# Altium schematic sheet etapa3.SchDoc
size Letter
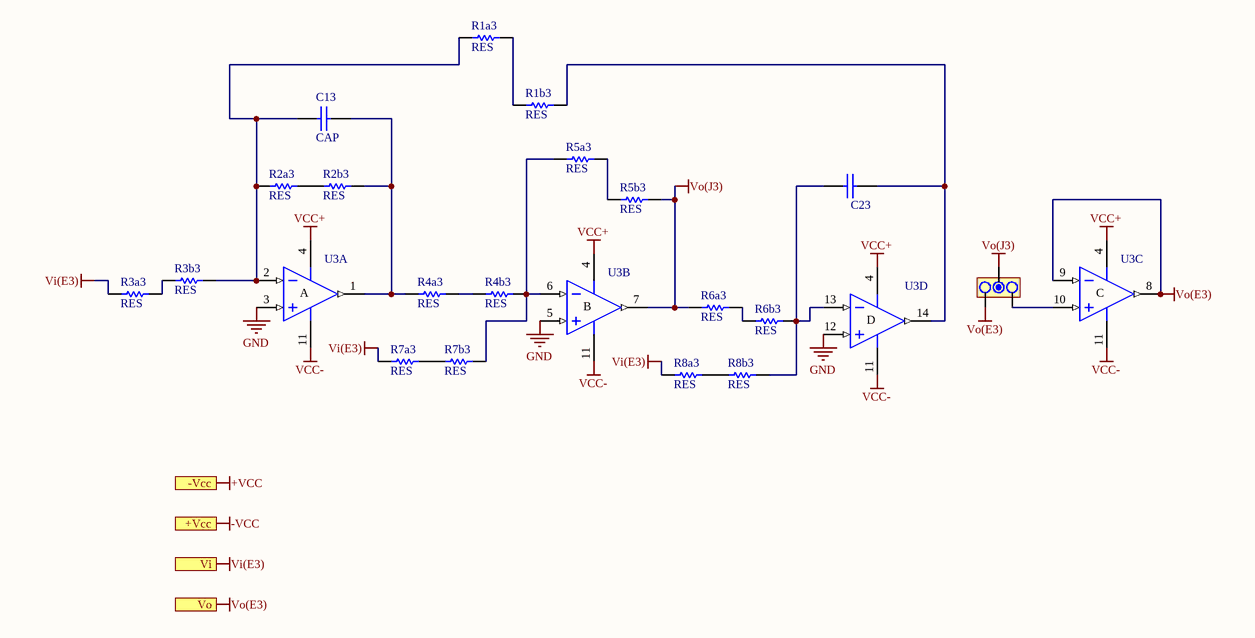
[diagram p0: etapa3.SchDoc]

## Parts
C13  CAP  [CAP200]
C23  CAP  [CAP200]  (value not drawn)
Jumper3  JUMPER  [JUMPER3]  (value not drawn)
R1a3  RES  [0805]
R1b3  RES  [0805]
R2a3  RES  [0805]
R2b3  RES  [0805]
R3a3  RES  [0805]
R3b3  RES  [0805]
R4a3  RES  [0805]
R4b3  RES  [0805]
R5a3  RES  [0805]
R5b3  RES  [0805]
R6a3  RES  [0805]
R6b3  RES  [0805]
R7a3  RES  [0805]
R7b3  RES  [0805]
R8a3  RES  [0805]
R8b3  RES  [0805]
U3  TL084N  [N014]  (value not drawn)  (parts A,B,C,D of 4)

## Ports
+Vcc, -Vcc, Vi, Vo

## Nets
+VCC: port -Vcc
-VCC: port +Vcc
GND: U3.3(IN+) U3.5(IN+) U3.12(IN+)
VCC+: U3.4(V+)
VCC-: U3.11(V-)
Vi(E3): R3a3.1 R7a3.1 R8a3.1 ; port Vi
Vo(E3): Jumper3.3 U3.8(OUT) U3.9(IN-) ; port Vo
Vo(J3): Jumper3.2 R5b3.2 R6a3.1 U3.7(OUT)
NetC13_1: C13.1 R1a3.1 R2a3.1 R3b3.2 U3.2(IN-)
NetC13_2: C13.2 R2b3.2 R4a3.1 U3.1(OUT)
NetC23_1: C23.1 R6b3.2 R8b3.2 U3.13(IN-)
NetC23_2: C23.2 R1b3.2 U3.14(OUT)
NetJumper3_1: Jumper3.1 U3.10(IN+)
NetR1a3_2: R1a3.2 R1b3.1
NetR2a3_2: R2a3.2 R2b3.1
NetR3a3_2: R3a3.2 R3b3.1
NetR4a3_2: R4a3.2 R4b3.1
NetR4b3_2: R4b3.2 R5a3.1 R7b3.2 U3.6(IN-)
NetR5a3_2: R5a3.2 R5b3.1
NetR6a3_2: R6a3.2 R6b3.1
NetR7a3_2: R7a3.2 R7b3.1
NetR8a3_2: R8a3.2 R8b3.1

## Notes on the sheet
- (in symbol TL084N, part A) A
- (in symbol TL084N, part B) B
- (in symbol TL084N, part C) C
- (in symbol TL084N, part D) D

## Library data of the parts
Jumper3 = JUMPER3
U3 = TL084N: JFET-Input Operational Amplifier; Published: 16-Jan-2001; LatestRevisionDate: 04-Mar-2005; LatestRevisionNote: Stylized 3D Model Added.; DatasheetVersion: Feb-1999; PackageVersion: Oct-1995; PackageReference: N014; Publisher: Altium Limited; PackageDescription: DIP; 14 Leads; Row Spacing 7.62 mm; Pitch 2.54 mm; ComponentLink1Description: Manufacturer Link; ComponentLink1URL: http://www.ti.com/; ComponentLink2Description: Datasheet; ComponentLink2URL: http://www-s.ti.com/sc/ds/tl084.pdf